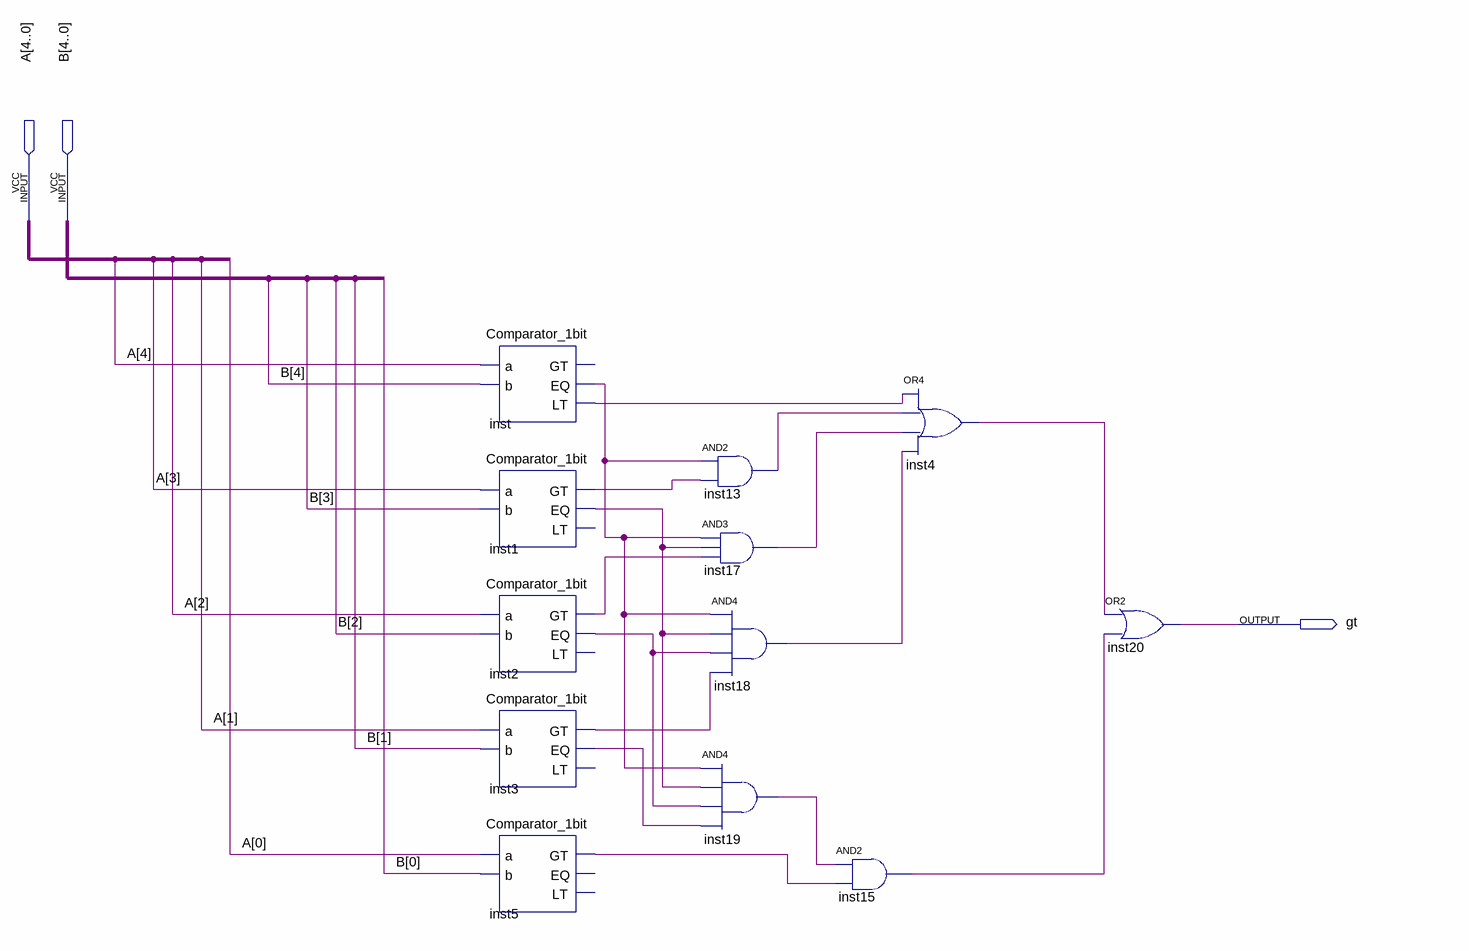
[diagram p0: schematic sheet]
// Quartus schematic GT.bdf as structural Verilog: 12 symbols, 3 pins
module GT (
  input  [4:0] A,
  input  [4:0] B,
  output gt
);

  wire inst1_eq, inst1_gt, inst2_eq, inst2_gt, inst3_eq, inst3_gt, inst4_out, inst5_gt, inst13_out,
       inst15_out, inst17_out, inst18_out, inst19_out, inst_eq, inst_lt;

  Comparator_1bit inst (.a(A[4]), .b(B[4]), .EQ(inst_eq), .LT(inst_lt));  // open: GT
  Comparator_1bit inst1 (.a(A[3]), .b(B[3]), .GT(inst1_gt), .EQ(inst1_eq));  // open: LT
  Comparator_1bit inst2 (.a(A[2]), .b(B[2]), .GT(inst2_gt), .EQ(inst2_eq));  // open: LT
  Comparator_1bit inst3 (.a(A[1]), .b(B[1]), .GT(inst3_gt), .EQ(inst3_eq));  // open: LT
  Comparator_1bit inst5 (.a(A[0]), .b(B[0]), .GT(inst5_gt));  // open: EQ, LT
  and inst13 (inst13_out, inst_eq, inst1_gt);
  and inst17 (inst17_out, inst_eq, inst1_eq, inst2_gt);
  and inst18 (inst18_out, inst_eq, inst1_eq, inst2_eq, inst3_gt);
  and inst19 (inst19_out, inst_eq, inst1_eq, inst2_eq, inst3_eq);
  and inst15 (inst15_out, inst19_out, inst5_gt);
  or inst4 (inst4_out, inst_lt, inst13_out, inst17_out, inst18_out);
  or inst20 (gt, inst4_out, inst15_out);
endmodule
